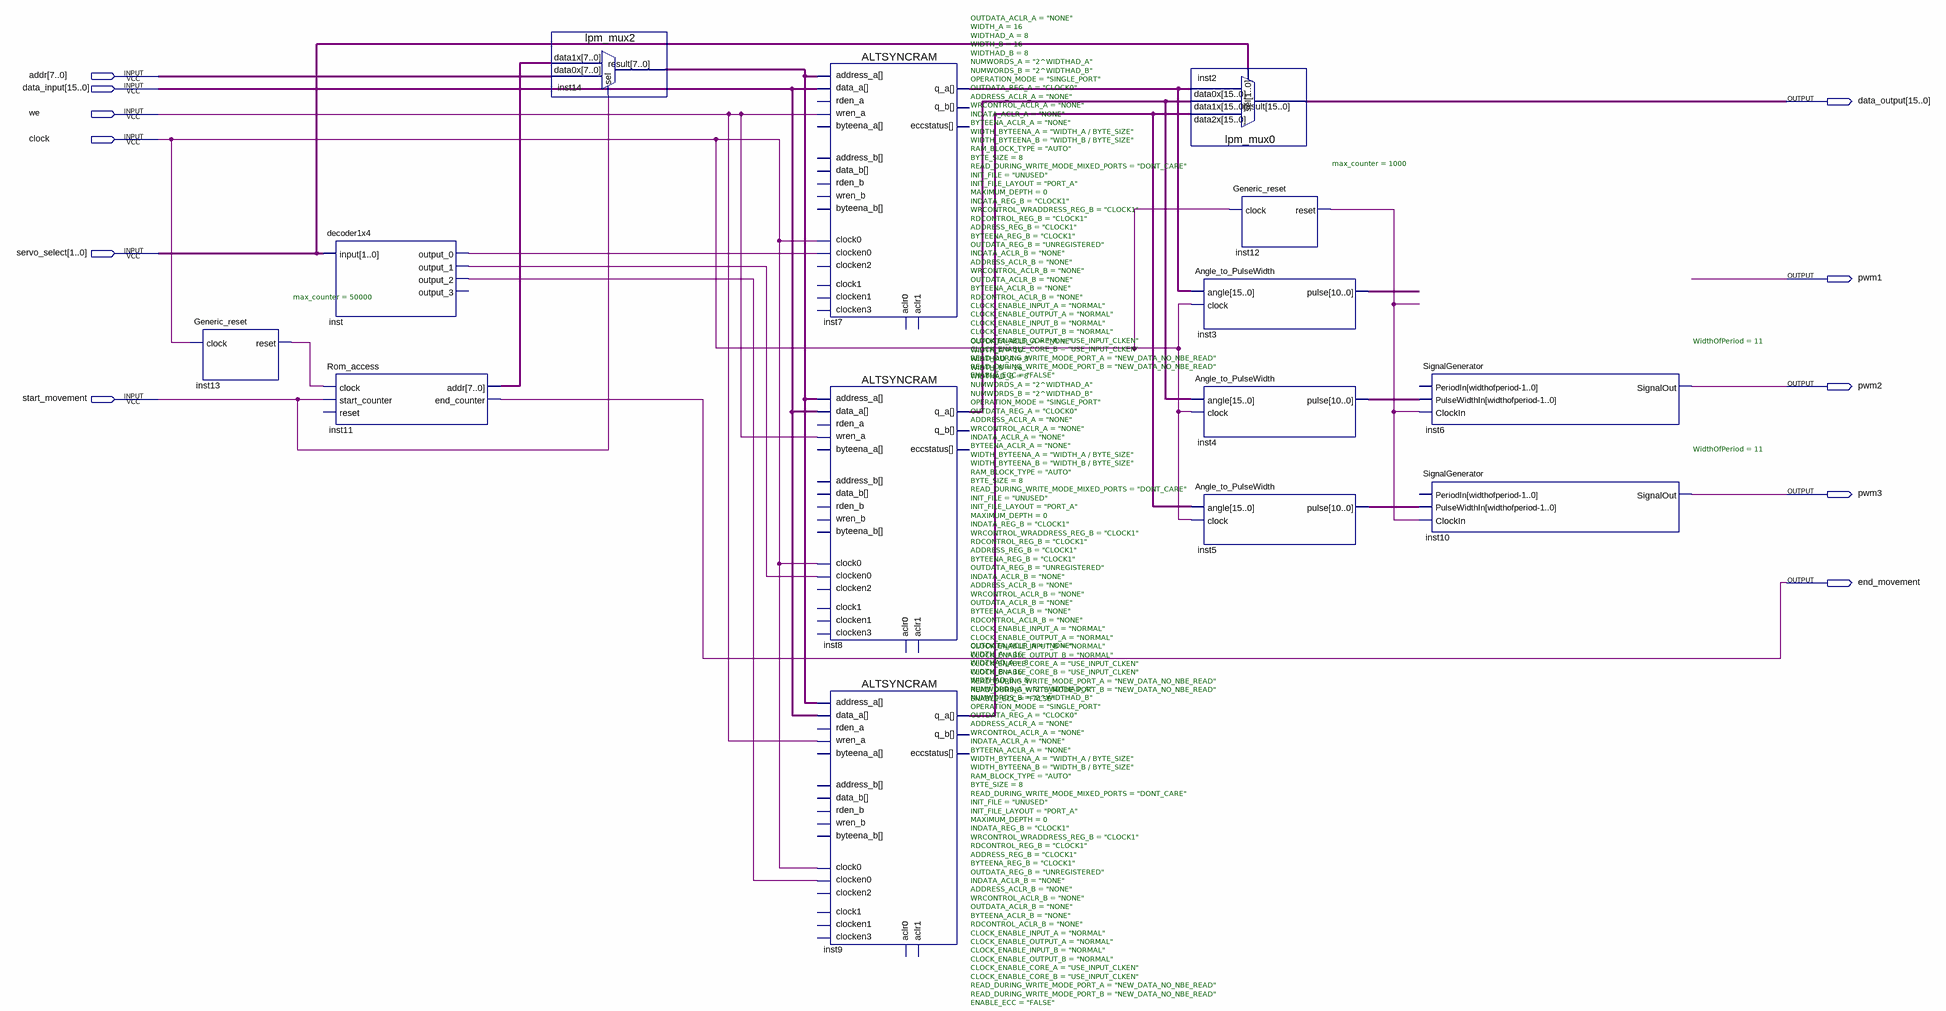
[diagram p0: schematic sheet]
// Quartus schematic leg.bdf as structural Verilog: 14 symbols, 11 pins
module leg (
  input  [7:0] addr,
  input  [15:0] data_input,
  input  we,
  input  clock,
  input  [1:0] servo_select,
  input  start_movement,
  output [15:0] data_output,
  output pwm1,
  output pwm2,
  output pwm3,
  output end_movement
);

  wire inst12_reset, inst13_reset, inst_output_0, inst_output_1, inst_output_2;
  wire [7:0] inst11_addr, inst14_result;
  wire [10:0] inst3_pulse, inst4_pulse, inst5_pulse;
  wire [15:0] inst7_q_a, inst8_q_a, inst9_q_a;

  Generic_reset #(.max_counter(50000)) inst13 (.clock(clock), .reset(inst13_reset));
  decoder1x4 inst (
    .\input (servo_select), .output_0(inst_output_0), .output_1(inst_output_1), .output_2(inst_output_2));  // open: output_3
  Rom_access inst11 (
    .clock(inst13_reset), .start_counter(start_movement), .addr(inst11_addr), .end_counter(end_movement));  // open: reset
  lpm_mux2 inst14 (.data1x(inst11_addr), .data0x(addr), .sel(start_movement), .result(inst14_result));
  ALTSYNCRAM #(.OUTDATA_ACLR_A("NONE"), .WIDTH_A(16), .WIDTHAD_A(8), .WIDTH_B(16), .WIDTHAD_B(8), .NUMWORDS_A("2^WIDTHAD_A"), .NUMWORDS_B("2^WIDTHAD_B"), .OPERATION_MODE("SINGLE_PORT"), .OUTDATA_REG_A("CLOCK0"), .ADDRESS_ACLR_A("NONE"), .WRCONTROL_ACLR_A("NONE"), .INDATA_ACLR_A("NONE"), .BYTEENA_ACLR_A("NONE"), .WIDTH_BYTEENA_A("WIDTH_A / BYTE_SIZE"), .WIDTH_BYTEENA_B("WIDTH_B / BYTE_SIZE"), .RAM_BLOCK_TYPE("AUTO"), .BYTE_SIZE(8), .READ_DURING_WRITE_MODE_MIXED_PORTS("DONT_CARE"), .INIT_FILE("UNUSED"), .INIT_FILE_LAYOUT("PORT_A"), .MAXIMUM_DEPTH(0), .INDATA_REG_B("CLOCK1"), .WRCONTROL_WRADDRESS_REG_B("CLOCK1"), .RDCONTROL_REG_B("CLOCK1"), .ADDRESS_REG_B("CLOCK1"), .BYTEENA_REG_B("CLOCK1"), .OUTDATA_REG_B("UNREGISTERED"), .INDATA_ACLR_B("NONE"), .ADDRESS_ACLR_B("NONE"), .WRCONTROL_ACLR_B("NONE"), .OUTDATA_ACLR_B("NONE"), .BYTEENA_ACLR_B("NONE"), .RDCONTROL_ACLR_B("NONE"), .CLOCK_ENABLE_INPUT_A("NORMAL"), .CLOCK_ENABLE_OUTPUT_A("NORMAL"), .CLOCK_ENABLE_INPUT_B("NORMAL"), .CLOCK_ENABLE_OUTPUT_B("NORMAL"), .CLOCK_ENABLE_CORE_A("USE_INPUT_CLKEN"), .CLOCK_ENABLE_CORE_B("USE_INPUT_CLKEN"), .READ_DURING_WRITE_MODE_PORT_A("NEW_DATA_NO_NBE_READ"), .READ_DURING_WRITE_MODE_PORT_B("NEW_DATA_NO_NBE_READ"), .ENABLE_ECC("FALSE")) inst7 (
    .address_a(inst14_result), .wren_a(we), .clock0(clock), .clocken0(inst_output_0), .data_a(data_input),
    .q_a(inst7_q_a));  // open: byteena_a, data_b, rden_b, wren_b, byteena_b, clock1, clocken1, aclr0, aclr1, address_b, clocken3, clocken2, rden_a, q_b, eccstatus
  ALTSYNCRAM #(.OUTDATA_ACLR_A("NONE"), .WIDTH_A(16), .WIDTHAD_A(8), .WIDTH_B(16), .WIDTHAD_B(8), .NUMWORDS_A("2^WIDTHAD_A"), .NUMWORDS_B("2^WIDTHAD_B"), .OPERATION_MODE("SINGLE_PORT"), .OUTDATA_REG_A("CLOCK0"), .ADDRESS_ACLR_A("NONE"), .WRCONTROL_ACLR_A("NONE"), .INDATA_ACLR_A("NONE"), .BYTEENA_ACLR_A("NONE"), .WIDTH_BYTEENA_A("WIDTH_A / BYTE_SIZE"), .WIDTH_BYTEENA_B("WIDTH_B / BYTE_SIZE"), .RAM_BLOCK_TYPE("AUTO"), .BYTE_SIZE(8), .READ_DURING_WRITE_MODE_MIXED_PORTS("DONT_CARE"), .INIT_FILE("UNUSED"), .INIT_FILE_LAYOUT("PORT_A"), .MAXIMUM_DEPTH(0), .INDATA_REG_B("CLOCK1"), .WRCONTROL_WRADDRESS_REG_B("CLOCK1"), .RDCONTROL_REG_B("CLOCK1"), .ADDRESS_REG_B("CLOCK1"), .BYTEENA_REG_B("CLOCK1"), .OUTDATA_REG_B("UNREGISTERED"), .INDATA_ACLR_B("NONE"), .ADDRESS_ACLR_B("NONE"), .WRCONTROL_ACLR_B("NONE"), .OUTDATA_ACLR_B("NONE"), .BYTEENA_ACLR_B("NONE"), .RDCONTROL_ACLR_B("NONE"), .CLOCK_ENABLE_INPUT_A("NORMAL"), .CLOCK_ENABLE_OUTPUT_A("NORMAL"), .CLOCK_ENABLE_INPUT_B("NORMAL"), .CLOCK_ENABLE_OUTPUT_B("NORMAL"), .CLOCK_ENABLE_CORE_A("USE_INPUT_CLKEN"), .CLOCK_ENABLE_CORE_B("USE_INPUT_CLKEN"), .READ_DURING_WRITE_MODE_PORT_A("NEW_DATA_NO_NBE_READ"), .READ_DURING_WRITE_MODE_PORT_B("NEW_DATA_NO_NBE_READ"), .ENABLE_ECC("FALSE")) inst8 (
    .address_a(inst14_result), .wren_a(we), .clock0(clock), .clocken0(inst_output_1), .data_a(data_input),
    .q_a(inst8_q_a));  // open: byteena_a, data_b, rden_b, wren_b, byteena_b, clock1, clocken1, aclr0, aclr1, address_b, clocken3, clocken2, rden_a, q_b, eccstatus
  ALTSYNCRAM #(.OUTDATA_ACLR_A("NONE"), .WIDTH_A(16), .WIDTHAD_A(8), .WIDTH_B(16), .WIDTHAD_B(8), .NUMWORDS_A("2^WIDTHAD_A"), .NUMWORDS_B("2^WIDTHAD_B"), .OPERATION_MODE("SINGLE_PORT"), .OUTDATA_REG_A("CLOCK0"), .ADDRESS_ACLR_A("NONE"), .WRCONTROL_ACLR_A("NONE"), .INDATA_ACLR_A("NONE"), .BYTEENA_ACLR_A("NONE"), .WIDTH_BYTEENA_A("WIDTH_A / BYTE_SIZE"), .WIDTH_BYTEENA_B("WIDTH_B / BYTE_SIZE"), .RAM_BLOCK_TYPE("AUTO"), .BYTE_SIZE(8), .READ_DURING_WRITE_MODE_MIXED_PORTS("DONT_CARE"), .INIT_FILE("UNUSED"), .INIT_FILE_LAYOUT("PORT_A"), .MAXIMUM_DEPTH(0), .INDATA_REG_B("CLOCK1"), .WRCONTROL_WRADDRESS_REG_B("CLOCK1"), .RDCONTROL_REG_B("CLOCK1"), .ADDRESS_REG_B("CLOCK1"), .BYTEENA_REG_B("CLOCK1"), .OUTDATA_REG_B("UNREGISTERED"), .INDATA_ACLR_B("NONE"), .ADDRESS_ACLR_B("NONE"), .WRCONTROL_ACLR_B("NONE"), .OUTDATA_ACLR_B("NONE"), .BYTEENA_ACLR_B("NONE"), .RDCONTROL_ACLR_B("NONE"), .CLOCK_ENABLE_INPUT_A("NORMAL"), .CLOCK_ENABLE_OUTPUT_A("NORMAL"), .CLOCK_ENABLE_INPUT_B("NORMAL"), .CLOCK_ENABLE_OUTPUT_B("NORMAL"), .CLOCK_ENABLE_CORE_A("USE_INPUT_CLKEN"), .CLOCK_ENABLE_CORE_B("USE_INPUT_CLKEN"), .READ_DURING_WRITE_MODE_PORT_A("NEW_DATA_NO_NBE_READ"), .READ_DURING_WRITE_MODE_PORT_B("NEW_DATA_NO_NBE_READ"), .ENABLE_ECC("FALSE")) inst9 (
    .address_a(inst14_result), .wren_a(we), .clock0(clock), .clocken0(inst_output_2), .data_a(data_input),
    .q_a(inst9_q_a));  // open: byteena_a, data_b, rden_b, wren_b, byteena_b, clock1, clocken1, aclr0, aclr1, address_b, clocken3, clocken2, rden_a, q_b, eccstatus
  lpm_mux0 inst2 (.data2x(inst9_q_a), .data1x(inst8_q_a), .data0x(inst7_q_a), .sel(servo_select), .result(data_output));
  Angle_to_PulseWidth inst3 (.angle(inst7_q_a), .clock(clock), .pulse(inst3_pulse));
  Angle_to_PulseWidth inst4 (.angle(inst8_q_a), .clock(clock), .pulse(inst4_pulse));
  Angle_to_PulseWidth inst5 (.angle(inst9_q_a), .clock(clock), .pulse(inst5_pulse));
  Generic_reset #(.max_counter(1000)) inst12 (.clock(clock), .reset(inst12_reset));
  SignalGenerator #(.WidthOfPeriod(11)) inst6 (
    .PulseWidthIn(inst4_pulse), .ClockIn(inst12_reset), .SignalOut(pwm2));  // open: PeriodIn
  SignalGenerator #(.WidthOfPeriod(11)) inst10 (
    .PulseWidthIn(inst5_pulse), .ClockIn(inst12_reset), .SignalOut(pwm3));  // open: PeriodIn
endmodule
